# Altium schematic sheet 三极管驱动电路.SchDoc
size A4
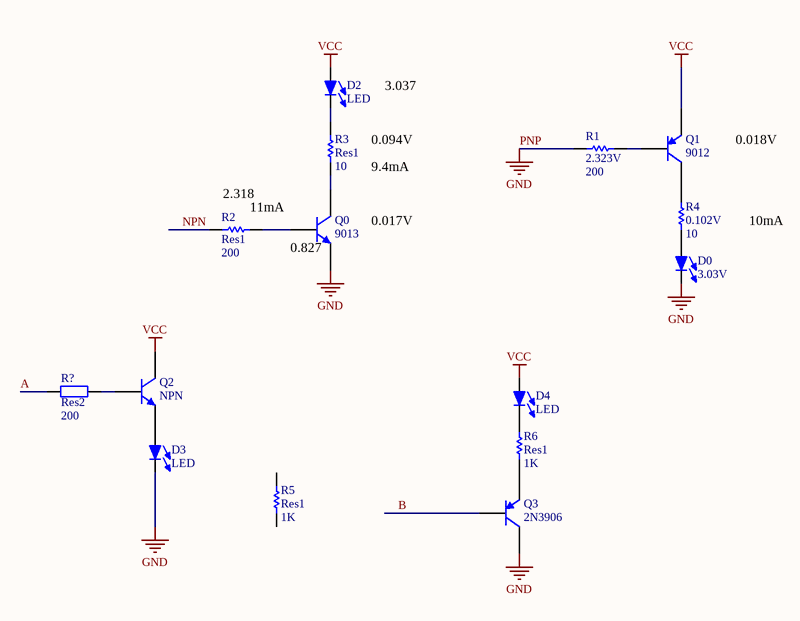
[diagram p0: 三极管驱动电路.SchDoc]

## Parts
D0  3.03V  [LED_3528]
D2  LED  [LED_3528]
D3  LED  [LED_3528]
D4  LED  [LED_3528]
Q0  9013  [TO-226-AA]
Q1  9012  [TO-92A]
Q2  NPN  [TO-226-AA]
Q3  2N3906  [TO-92A]
R1  2.323V  value 200  [6-0805_N]
R2  Res1  value 200  [6-0805_N]
R3  Res1  value 10  [6-0805_N]
R4  0.102V  value 10  [6-0805_N]
R5  Res1  value 1K  [6-0805_N]
R6  Res1  value 1K  [6-0805_N]
R?  Res2  value 200  [6-0805_N]

## Nets
PNP: D0.2 D3.2 Q0.3(E) Q3.3(C) R1.1  [also labelled GND]
VCC: D2.1 D4.1 Q1.1(E) Q2.1(C)
A: R?.1
B: Q3.2(B)
NPN: R2.1
NetD0_1: D0.1 R4.1
NetD2_2: D2.2 R3.2
NetD3_1: D3.1 Q2.3(E)
NetD4_2: D4.2 R6.2
NetQ0_1: Q0.1(C) R3.1
NetQ0_2: Q0.2(B) R2.2
NetQ1_2: Q1.2(B) R1.2
NetQ1_3: Q1.3(C) R4.2
NetQ2_2: Q2.2(B) R?.2
NetQ3_1: Q3.1(E) R6.1

Not connected (* = marked no-connect by the designer): R5 1 2

## Notes on the sheet
- 0.094V
- 3.037
- 0.018V
- (near R2) 2.318
- (near R2) 11mA
- 9.4mA
- (near Q0) 0.827
- (near Q0) 0.017V
- 10mA

## Library data of the parts
D0 = LED
Q0 Q2 = NPN: NPN Bipolar Transistor; Published: 8-Jun-2000; LatestRevisionDate: 17-Jul-2002; LatestRevisionNote: Re-released for DXP Platform.; PackageReference: TO-226-AA; Publisher: Altium Limited; PackageDescription: TO, Flat Index; 3 In-Line, Axial Leads; Body Dia. 4.8mm; Leads 0.55 x 0.51 mm (max); Code_JEDEC: TO-226-AA
Q1 Q3 = 2N3906: PNP General Purpose Amplifier; Published: 8-Jun-2000; LatestRevisionDate: 15-Jan-2003; LatestRevisionNote: PCB Footprint 'BCY-W3/D4.7' replaced; DatasheetVersion: 1997; PackageVersion: Sep-1998; PackageReference: TO-92A; Publisher: Altium Limited; PackageDescription: TO, Flat Index; 3 In-Line, Axial Leads; Body Dia. 4.5mm; Leads 0.51 x 0.48 mm (max); ComponentLink1Description: Manufacturer Link; ComponentLink1URL: http://www.fairchildsemi.com/; ComponentLink2Description: Datasheet; ComponentLink2URL: http://www.fairchildsemi.com/ds/2N%2F2N3906.pdf
R1-R6 = Res1: Resistor; Published: 8-Jun-2000; LatestRevisionDate: 17-Jul-2002; LatestRevisionNote: Re-released for DXP Platform.; PackageReference: AXIAL-0.3; Publisher: Altium Limited; PackageDescription: Axial Device, Thru-Hole; 2 Leads; 0.3 in Pin Spacing
R? = Res2: Resistor; Published: 8-Jun-2000; LatestRevisionDate: 17-Jul-2002; LatestRevisionNote: Re-released for DXP Platform.; PackageReference: AXIAL-0.4; Publisher: Altium Limited; PackageDescription: Axial Device, Thru-Hole; 2 Leads; 0.4 in Pin Spacing